# EAGLE design circuit (EAGLE 9.5.2)
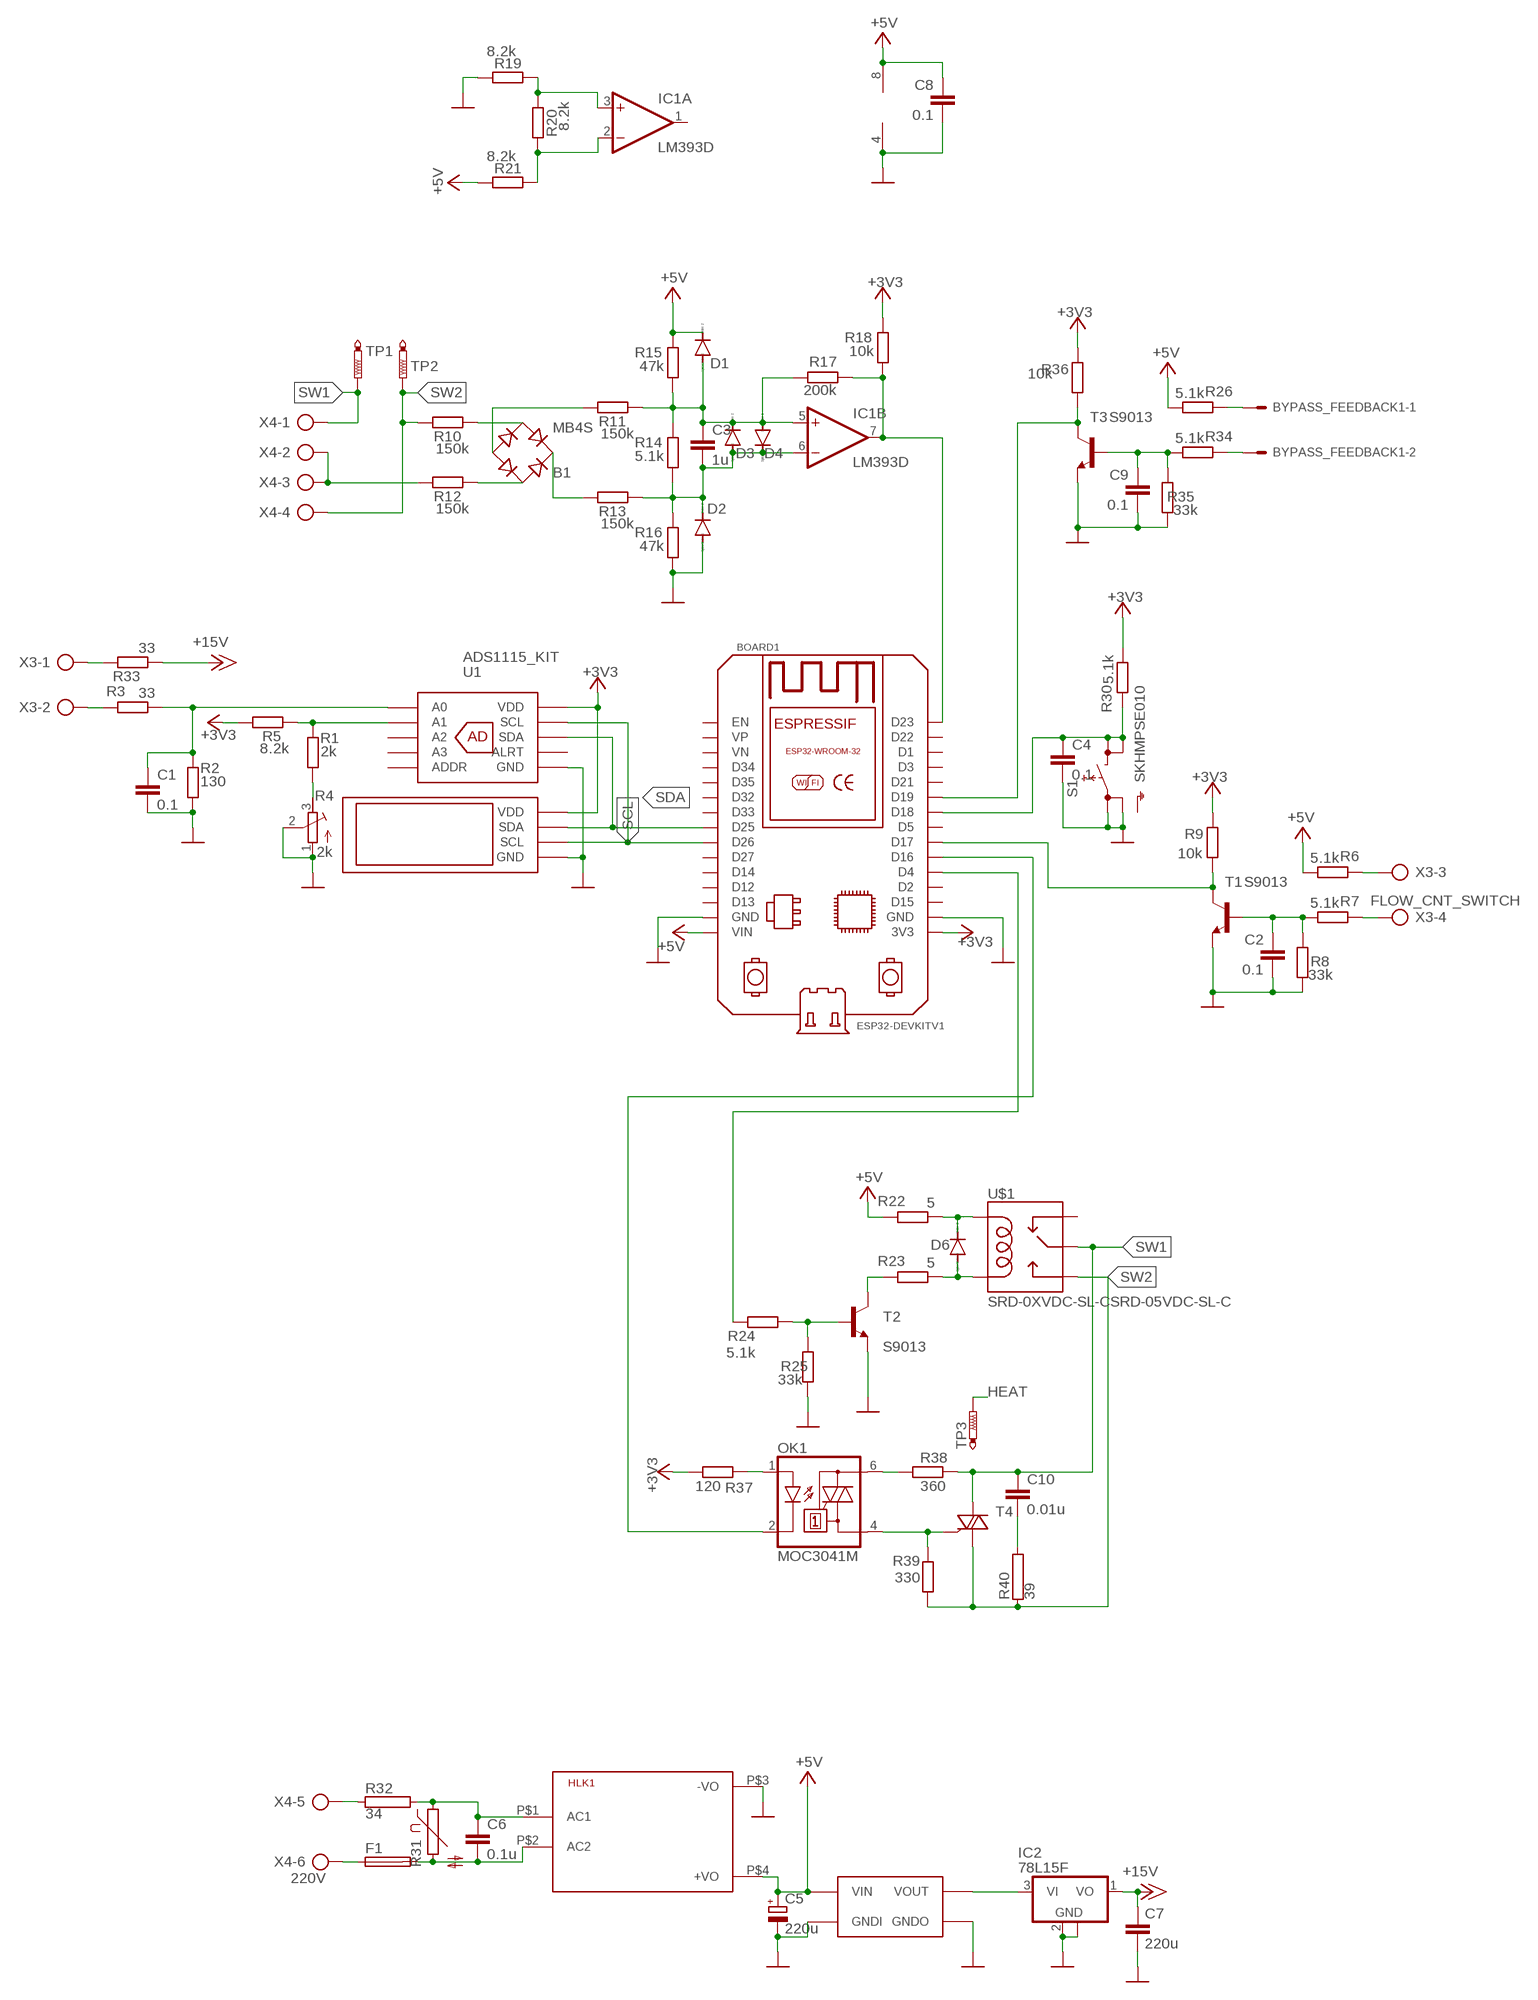
[diagram p0: schematic, sheet 1]

## Parts
B1  MB4S  [SOIC-4]
BOARD1  ESP32DEVKITV1  [ESP32-DEVKITV1]
BYPASS_FEEDBACK1  C-GRID-02-70543  [70543-02]
C1  0.1  C-EUC1206  [C1206]
C2  0.1  C-EUC1206  [C1206]
C3  1u  C-EUC1206  [C1206]
C4  0.1  C-EUC1206  [C1206]
C5  220u  CPOL-EUE3.5-8  [E3,5-8]
C6  0.1u  C10/5  [C10B5]
C7  220u  C-EUC1210K  [C1210K]
C8  0.1  C-EUC1206  [C1206]
C9  0.1  C-EUC1206  [C1206]
C10  0.01u  C10/5  [C10B5]
D1  CGRM4001-G  [SOD-123_MINI-SMA]
D2  CGRM4001-G  [SOD-123_MINI-SMA]
D3  CGRM4001-G  [SOD-123_MINI-SMA]
D4  CGRM4001-G  [SOD-123_MINI-SMA]
D6  CGRM4001-G  [SOD-123_MINI-SMA]
DC1  HW-668_DC_DC_STEPUP  [HW-668_DC_DC_STEPUP]
F1  FUSE19560  [19560]
HLK1  HLK-PM013W  [HLK-PM01]
IC1  LM393D  [SO08]
IC2  78L15F  [SOT89]
OK1  MOC3041M  [DIL06]
R1  2k  R-EU_R1206  [R1206]
R2  130  R-EU_R1206  [R1206]
R3  33  R-EU_R1206  [R1206]
R4  2k  R-TRIMM3202  [RTRIM3202]
R5  8.2k  R-EU_R1206  [R1206]
R6  5.1k  R-EU_R1206  [R1206]
R7  5.1k  R-EU_R1206  [R1206]
R8  33k  R-EU_R1206  [R1206]
R9  10k  R-EU_R1206  [R1206]
R10  150k  R-EU_R1206  [R1206]
R11  150k  R-EU_R1206  [R1206]
R12  150k  R-EU_R1206  [R1206]
R13  150k  R-EU_R1206  [R1206]
R14  5.1k  R-EU_R1206  [R1206]
R15  47k  R-EU_R1206  [R1206]
R16  47k  R-EU_R1206  [R1206]
R17  200k  R-EU_R1206  [R1206]
R18  10k  R-EU_R1206  [R1206]
R19  8.2k  R-EU_R1206  [R1206]
R20  8.2k  R-EU_R1206  [R1206]
R21  8.2k  R-EU_R1206  [R1206]
R22  5  R-EU_R1206  [R1206]
R23  5  R-EU_R1206  [R1206]
R24  5.1k  R-EU_R1206  [R1206]
R25  33k  R-EU_R1206  [R1206]
R26  5.1k  R-EU_R1206  [R1206]
R30  5.1k  R-EU_R1206  [R1206]
R31  S10K510  [S10K510]
R32  34  RCA0001  [CA0001]
R33  33  R-EU_R1206  [R1206]
R34  5.1k  R-EU_R1206  [R1206]
R35  33k  R-EU_R1206  [R1206]
R36  10k  R-EU_R1206  [R1206]
R37  120  R-EU_R1206  [R1206]
R38  360  R-EU_R1206  [R1206]
R39  330  R-EU_R1206  [R1206]
R40  39  RCA0001  [CA0001]
S1  SKHMPSE010  [SKHMPXE010]
T1  S9013  BC808-NPN-SOT23-BEC  [SOT23-BEC]
T2  S9013  BC808-NPN-SOT23-BEC  [SOT23-BEC]
T3  S9013  BC808-NPN-SOT23-BEC  [SOT23-BEC]
T4  BT136  [TO220AB]
TP1  PTR1PAD1-20Y  [P1-20Y]
TP2  PTR1PAD1-20Y  [P1-20Y]
TP3  PTR1B1,27  [B1,27]
U1  ADS1115_KIT  [ADS1115_KIT]
U2  SSD1306_OLED  [SSD1306_OLED]
U$1  SRD-0XVDC-SL-CSRD-05VDC-SL-C  [SRD-0XVDC-SL-C]
X3  FLOW_CNT_SWITCH  AK300/4  [AK300/4]
X4  220V  AK300/6  [AK300/6]

## Nets
+3V3: BOARD1.3V3 R5.2 R9.1 R18.1 R30.1 R36.1 R37.1 U1.P$1(VDD) U2.P$3(VDD)
+5V: BOARD1.VIN C5.+ C8.1 D1.C DC1.P$1(VIN) HLK1.P$4(+VO) IC1.8(P:V+) R6.1 R15.1 R21.1 R22.2 R26.1
+15V: C7.1 IC2.1(VO) R33.1
FLOW_SW: BOARD1.D17 R9.2 T1.C
GND: BOARD1.GND BOARD1.GND@1(GND) C1.2 C2.2 C4.2 C5.- C7.2 C8.2 C9.2 D2.A DC1.P$2(GNDI) DC1.P$3(GNDO) HLK1.P$3(-VO) IC1.4(P:V-) IC2.2(GND) IC2.2@1(GND) R2.1 R4.1(A) R4.2(S) R8.2 R16.2 R19.1 R25.2 R35.2 S1.1(1.1) S1.2(1.2) T1.E T2.E T3.E U1.P$2(GND) U2.P$4(GND)
HEAT: TP3.TP
N$1: C9.1 R34.1 R35.1 T3.B
N$2: BYPASS_FEEDBACK1.1 R26.2
N$3: C1.1 R2.2 R3.1 U1.P$7(A0)
N$4: R1.2 R5.1 U1.P$8(A1)
N$5: R1.1 R4.3(E)
N$6: C2.1 R7.1 R8.1 T1.B
N$7: R33.2 X3.1
N$8: B1.+ R13.2
N$9: C3.2 D2.C D3.A D4.C IC1.6(B:-IN) R13.1 R14.2 R16.1
N$10: C3.1 D1.A D3.C D4.A IC1.5(B:+IN) R11.1 R14.1 R15.2 R17.1
N$11: B1.- R11.2
N$12: R32.1 X4.5
N$13: B1.~2(AC2) R10.1
N$14: B1.~1(AC1) R12.1
N$15: R23.2 T2.C
N$16: IC1.3(A:+IN) R19.2 R20.1
N$17: IC1.2(A:-IN) R20.2 R21.2
N$18: D6.C R22.1 U$1.COIL1
N$19: F1.1 X4.6
N$20: R3.2 X3.2
N$21: BYPASS_FEEDBACK1.2 R34.2
N$22: R24.1 R25.1 T2.B
N$23: R12.2 X4.2 X4.3
N$24: R6.2 X3.3
N$25: C6.1 HLK1.P$1(AC1) R31.1 R32.2
N$26: C6.2 F1.2 HLK1.P$2(AC2) R31.2
N$27: D6.A R23.1 U$1.COIL0
N$28: DC1.P$4(VOUT) IC2.3(VI)
N$29: R7.2 X3.4
N$30: BOARD1.D19 R36.2 T3.C
N$31: BOARD1.D16 OK1.2(C)
N$32: OK1.1(A) R37.2
N$34: OK1.6(A2) R38.1
N$39: OK1.4(A1) R39.2 T4.3(G)
N$41: C10.2 R40.2
PP_ON: BOARD1.D23 IC1.7(B:OUT) R17.2 R18.2
RST_ALR: BOARD1.D18 C4.1 R30.2 S1.3(2.1) S1.4(2.2)
SCL: BOARD1.D26 U1.P$3(SCL) U2.P$2(SCL)
SDA: BOARD1.D25 U1.P$4(SDA) U2.P$1(SDA)
SSRELAY_ON: BOARD1.D4 R24.2
SW1: C10.1 R38.2 T4.2(A2) TP1.TP U$1.SWCOMMON X4.1
SW2: R10.2 R39.1 R40.1 T4.1(A1) TP2.TP U$1.SWOPEN X4.4
Unconnected: BOARD1.D1 BOARD1.D2 BOARD1.D3 BOARD1.D5 BOARD1.D12 BOARD1.D13 BOARD1.D14 BOARD1.D15 BOARD1.D21 BOARD1.D22 BOARD1.D27 BOARD1.D32 BOARD1.D33 BOARD1.D34 BOARD1.D35 BOARD1.EN BOARD1.VN BOARD1.VP IC1.1(A:OUT) S1.5(SH) U1.P$5(ADDR) U1.P$6(ALRT) U1.P$9(A2) U1.P$10(A3) U$1.SWCLOSED(SWCLOSE)

## Library data of the parts
B1 = rectifier:MB*S: Bridge Rectifier Source: http://www.fairchildsemi.com/ds/MB/MB6S.pdf
BOARD1 = ESP32-DEVKITV1:ESP32DEVKITV1: https://github.com/shridattdudhat
BYPASS_FEEDBACK1 = con-molex:C-GRID-02: CONNECTOR wire to board 2.54 mm (0.100") pitch header; MF: MOLEX; OC_FARNELL: unknown; OC_NEWARK: unknown
C1-C4 C7-C9 = rcl:C-EU: CAPACITOR, European symbol; SPICEPREFIX: C
C5 = rcl:CPOL-EU: POLARIZED CAPACITOR, European symbol; SPICEPREFIX: C
C6 C10 = capacitor-wima:C: CAPACITOR naming: grid - package width
D1-D4 D6 = diode:CGRM400*-G: Molded plasitc,JEDEC SOD-123/Mini SMA Source: Comchip CGRM4001-G.pdf
DC1 = HW-668-stepUp_dcdc:HW-668_DC_DC_STEPUP
F1 = fuse:FUSE: Fuse; MPN: 56000001009; OC_FARNELL: 1185363; OC_NEWARK: 98K6125
HLK1 = HLK-PM01:HLK-PM01: Hi-Link Power Supply HLK-PM01 3W Author: Ahmed Said <https://github.com/AhmedSaid/EAGLELibraries>
IC1 = linear:LM393: COMPARATOR
IC2 = linear:78L*: POSITOIV-VOLTAGE REGULATORS Output up to 100 mA Source: Datasheet <http://focus.ti.com/lit/ds/symlink/ua78l05.pdf>
OK1 = optocoupler:MOC30*: 6-Pin DIP Zero-Cross Optoisolators Triac Driver Output (250/400 Volt Peak) Source: Data sheet <http://www.fairchildsemi.com/ds/MO/MOC3031M.pdf> The old path of data sheet not more available 2013-05-06.; MF: FAIRCHILD SEMICONDUCTOR; MPN: MOC3041M; OC_FARNELL: 1086677; OC_NEWARK: 78K6090
R1-R3 R5-R26 R30 R33-R39 = rcl:R-EU_: RESISTOR, European symbol; SPICEPREFIX: R
R4 = rcl:R-TRIMM: Trimm resistor; SPICEMODEL: X; SPICEPREFIXL: POT
R31 = varistor:S10K510: VARISTOR
R32 R40 = resistor-power:R: Power Resitor; OC_FARNELL: unknown; OC_NEWARK: unknown
S1 = switch:SKHMP*E010: 6.2 X 6.5mm TACT Switch (SMD) Source: http://www3.alps.co.jp/WebObjects/catalog.woa/PDF/E/Switch/Tact/SKHM/SKHM.PDF
T1-T3 = transistor:*-NPN-: NPN Transistror BF959 corrected 2008.03.06
T4 = triac:BT136: Triac BT136 series E sensitive gate Source: http://www.nxp.com/acrobat_download/datasheets/BT136_SERIES_E_2.pdf
TP1-TP3 = testpad:PTR1: TEST PIN
U1 = ads1115_kit:ADS1115_KIT: ads1115 16-bit ADC kit
U2 = SSD1306:SSD1306_OLED: SSD1306 OLED Display
U$1 = SRD-0XVDC-SL-C:SRD-0XVDC-SL-C: SRD-05VDC-SL-C SRD-06VDC-SL-C Compatible with: SONGLE Relays SHUN YU JQX-3F other same relays Author: Ahmed Said <https://github.com/AhmedSaid/EAGLELibraries>
X3 = con-ptr500:AK300/4: CONNECTOR; OC_FARNELL: unknown; OC_NEWARK: unknown
X4 = con-ptr500:AK300/6: CONNECTOR; OC_FARNELL: unknown; OC_NEWARK: unknown

## Board
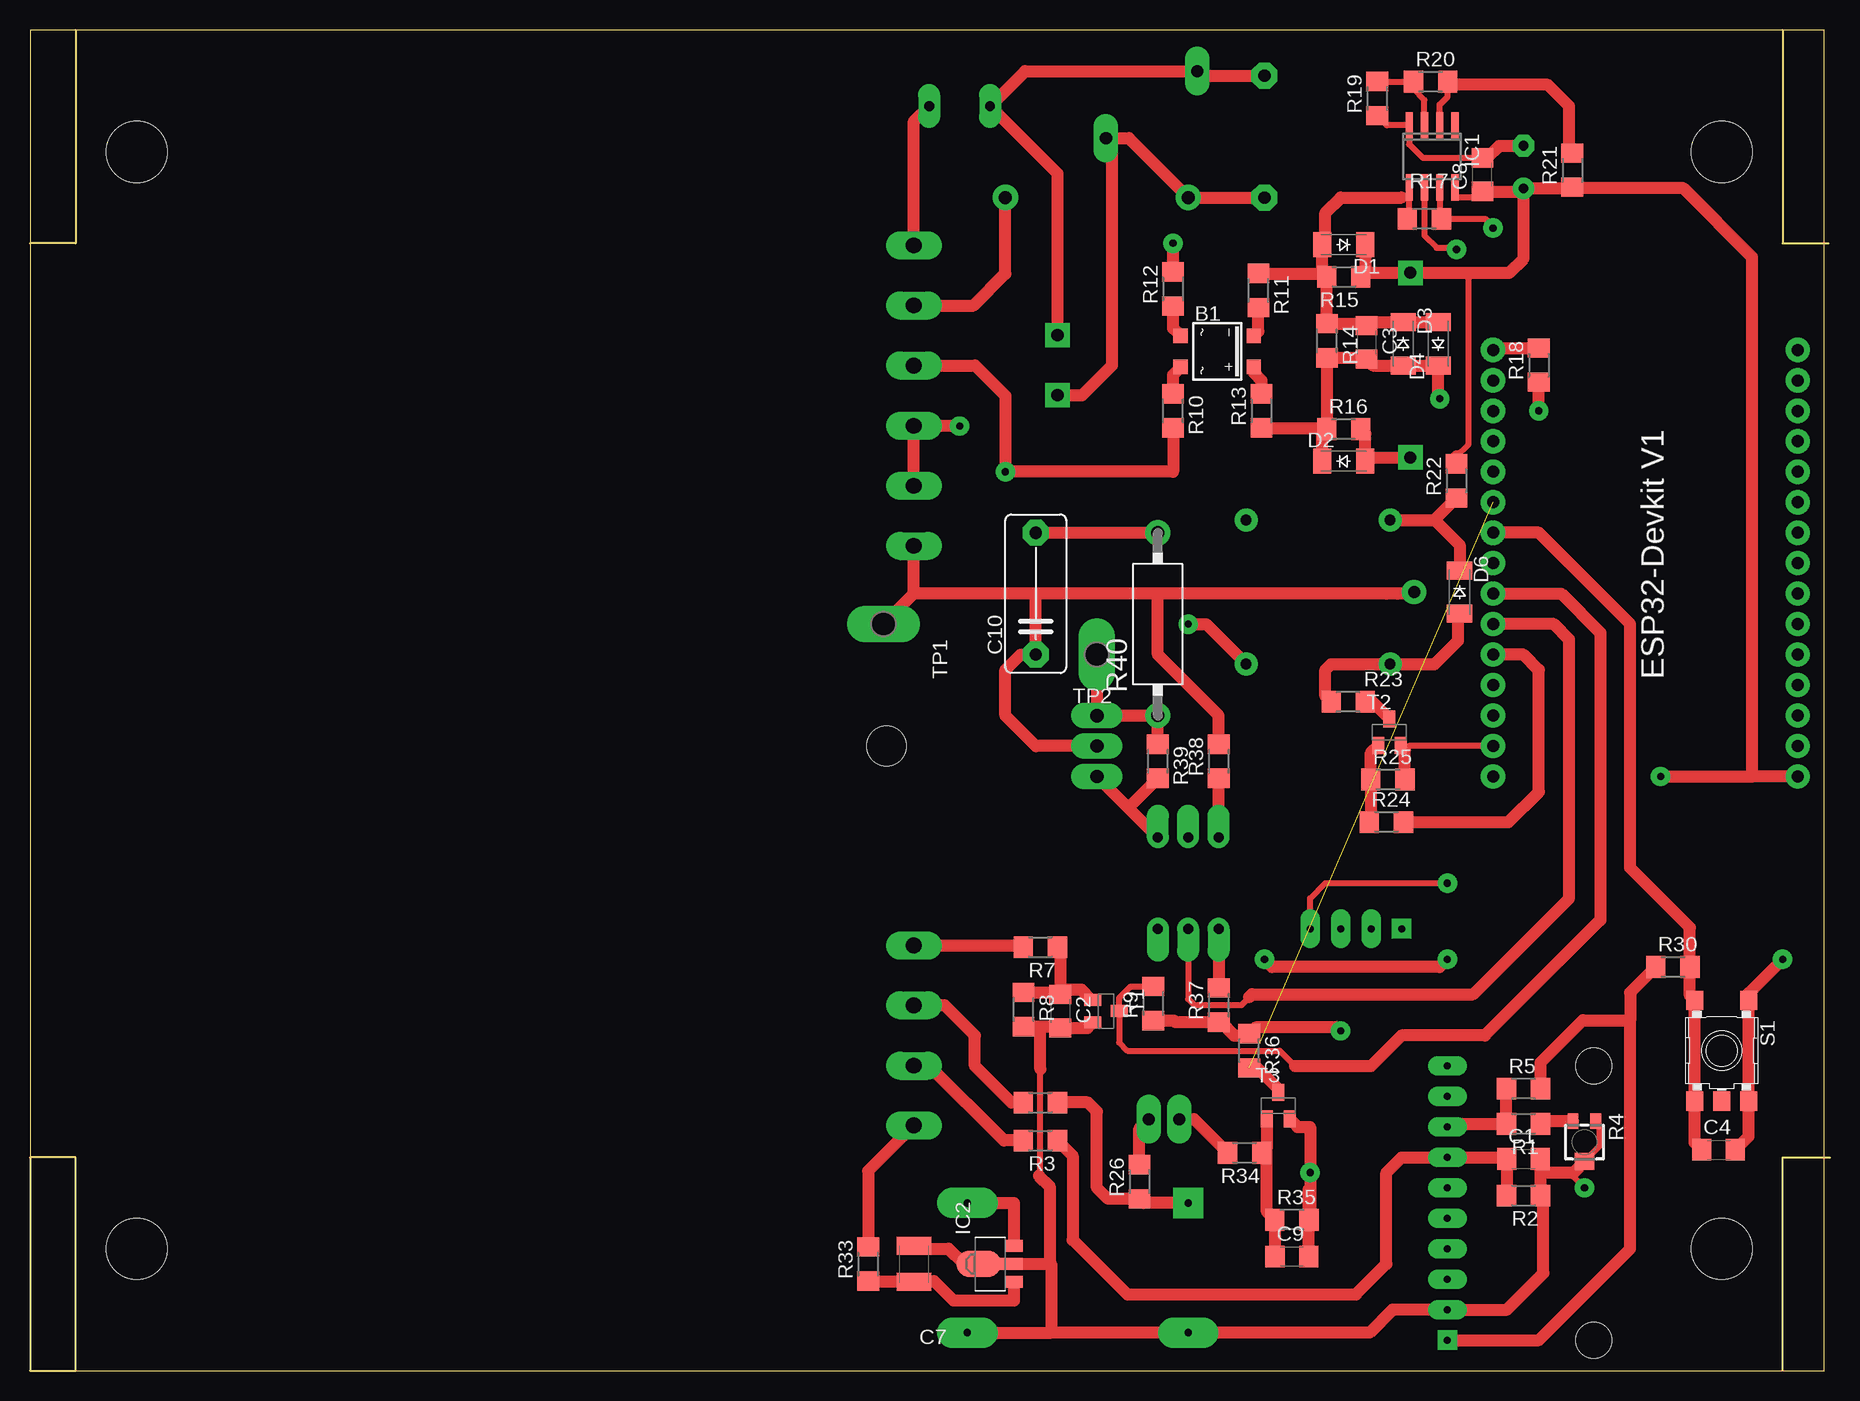
[diagram p1: board, top side]
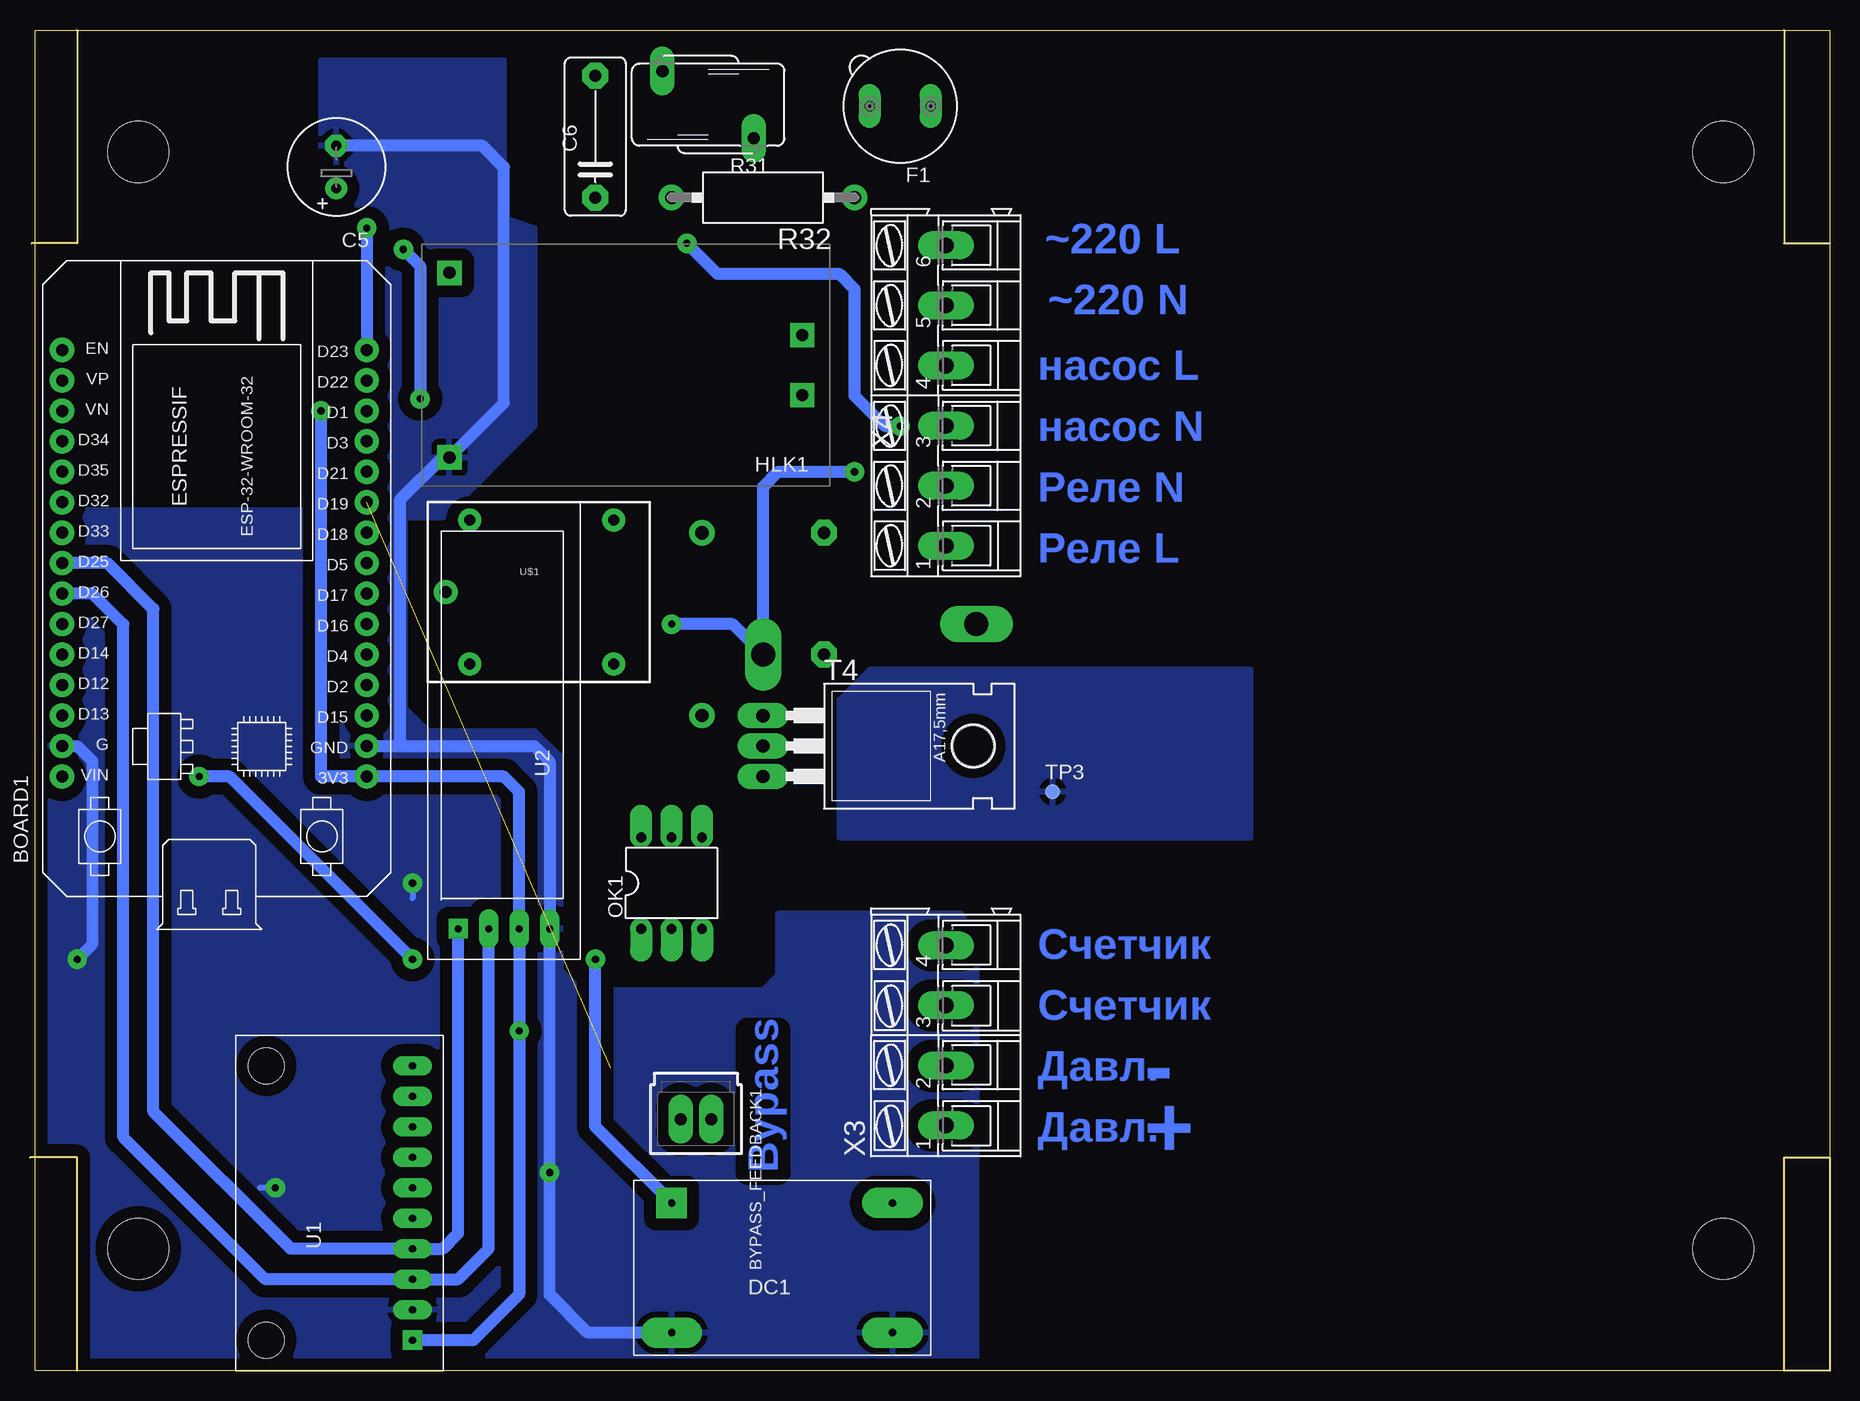
[diagram p2: board, bottom side, seen from below]

Size 149.99 x 111.76 mm. Coordinates in mm from the lower left corner, seen from the top.
Outline: 3.81,0 146.05,0
Outline: 146.05,0 149.53,0 149.53,111.75 0,111.75 0,93.98
Outline: 0,93.98 0,17.78
Outline: 3.81,0 3.81,17.78 0,17.78
Outline: 0,17.78 0,0 3.81,0
Outline: 3.81,111.76 3.81,93.98 0,93.98
Outline: 146.05,0 146.05,17.78 149.99,17.78
Outline: 146.05,111.76 146.05,93.98 149.86,93.98
Copper layers (1*16): Top 0.035mm / dielectric 1.5mm / Bottom 0.035mm
Design rules "default": minimum track width 20mil, minimum drill 0.6mm, track to track 12mil, track to pad 12mil, pad to pad 12mil, via to via 12mil, smd to smd 12mil, copper to edge 40mil, drill to drill 40mil, minimum pad ring 20mil, minimum via ring 20mil, stop-mask expansion 4mil, vias tented up to drill 0mil, thermal gap 20mil
Holes 5.08 mm at 8.89,10.16 8.89,101.6 140.97,10.16 140.97,101.6

### Footprints (pad centres in the part's own frame; a part is rotated, then mirrored left to right if it is on the bottom)
SOIC-4 = smd 1.2 x 1.2: + 1.3,3.05; - -1.3,3.05; ~1 -1.3,-3.05; ~2 1.3,-3.05
ESP32-DEVKITV1 = drill 1 pad 1.93: 3V3 0,0; D1 30.48,0; D2 7.62,0; D3 27.94,0; D4 10.16,0; D5 17.78,0; D12 7.62,25.4; D13 5.08,25.4; D14 10.16,25.4; D15 5.08,0; D16 12.7,0; D17 15.24,0; D18 20.32,0; D19 22.86,0; D21 25.4,0; D22 33.02,0; D23 35.56,0; D25 17.78,25.4; D26 15.24,25.4; D27 12.7,25.4; D32 22.86,25.4; D33 20.32,25.4; D34 27.94,25.4; D35 25.4,25.4; EN 35.56,25.4; GND 2.54,25.4; GND@1 2.54,0; VIN 0,25.4; VN 30.48,25.4; VP 33.02,25.4
70543-02 = drill 1.016 long: 1 -1.27,0; 2 1.27,0
C1206 = smd 1.6 x 1.8: 1 -1.4,0; 2 1.4,0
E3,5-8 = drill 0.813 pad 1.6: + -1.778,0 | drill 0.813 pad 1.6 octagon: - 1.778,0
C10B5 = drill 1.016 pad 2.159 octagon: 1 -5.08,0; 2 5.08,0
C1210K = smd 1.5 x 2.9: 1 -1.5,0; 2 1.5,0
SOD-123_MINI-SMA = smd 1.5 x 2.1: A 1.8,0; C -1.8,0
HW-668_DC_DC_STEPUP = drill 0.6 pad 2.54 square: P$1 -17.78,0 | drill 0.6 pad 2.54 long: P$2 -17.78,-10.795; P$3 0.635,-10.795; P$4 0.635,0
19560 = drill 0.813 pad 1.778 long: 1 -2.54,0; 2 2.54,0
HLK-PM01 = drill 1.016 square: P$1 -14.7,2.5; P$2 -14.7,-2.5; P$3 14.7,7.7; P$4 14.7,-7.7
SO08 = smd 0.6 x 2.2: 1 -1.905,-2.6; 2 -0.635,-2.6; 3 0.635,-2.6; 4 1.905,-2.6; 5 1.905,2.6; 6 0.635,2.6; 7 -0.635,2.6; 8 -1.905,2.6
SOT89 = smd 1 x 1.5: 1 -1.499,-1.981; 3 1.499,-1.981 | smd 1 x 2: 2 0,-1.727 | smd 2.2 x 3.7: 2@1 0,0.94
DIL06 = drill 0.813 offset: 1 -2.54,-3.81; 2 0,-3.81; 3 2.54,-3.81; 4 2.54,3.81; 5 0,3.81; 6 -2.54,3.81
R1206 = smd 1.6 x 1.803: 1 -1.422,0; 2 1.422,0
RTRIM3202 = smd 0.9 x 1.3: 1 -0.95,-1.75; 3 0.95,-1.75 | smd 1.6 x 1.4: 2 0,1.6
S10K510 = drill 1.016 long: 1 -2.794,-3.81; 2 2.794,3.81
CA0001 = drill 1.1 pad 2: 1 -7.62,0; 2 7.62,0
SKHMPXE010 = smd 1.6 x 1.4: 1 -4.2,2.25; 2 4.2,2.25; 3 -4.2,-2.25; 4 4.2,-2.25; 5 4.2,0
SOT23-BEC = smd 1 x 1.4: B -0.95,-1.1; C 0,1.1; E 0.95,-1.1
TO220AB = drill 1.118 long: 1 -2.54,-6.35; 2 0,-6.35; 3 2.54,-6.35 | hole 3.302: 0,11.176
P1-20Y = drill 2.007 pad 2.54 long: TP 0,0
B1,27 = smd 1.27 x 1.27: TP 0,0
ADS1115_KIT = drill 0.6 square: P$1 -5.08,12.7 | drill 0.6 long: P$2 -5.08,10.16; P$3 -5.08,7.62; P$4 -5.08,5.08; P$5 -5.08,2.54; P$6 -5.08,0; P$7 -5.08,-2.54; P$8 -5.08,-5.08; P$9 -5.08,-7.62; P$10 -5.08,-10.16 | hole 2.997: 7.112,12.7; 7.112,-10.16
SSD1306_OLED = drill 0.6 square: P$1 -15.24,5.08 | drill 0.6 long: P$2 -15.24,2.54; P$3 -15.24,0; P$4 -15.24,-2.54
SRD-0XVDC-SL-C = drill 0.9: COIL0 -5.39,-6.12; COIL1 -5.39,5.88; SWCLOSED 6.61,5.88; SWOPEN 6.61,-6.12 | drill 1: SWCOMMON -7.39,-0.12
AK300/4 = drill 1.321 long: 1 -7.493,0; 2 -2.515,0; 3 2.515,0; 4 7.493,0
AK300/6 = drill 1.321 long: 1 -12.522,0; 2 -7.518,0; 3 -2.515,0; 4 2.515,0; 5 7.518,0; 6 12.522,0

### Placement (x,y rotation side)
B1  98.93,84.96 270 top
BOARD1  121.92,49.53 90 bottom
BYPASS_FEEDBACK1  94.49,20.95 180 bottom
C1  124.46,17.65 0 top
C2  85.85,29.97 270 top
C3  111.38,85.72 270 top
C4  140.72,18.41 0 top
C5  124.46,100.33 90 bottom
C6  102.87,102.87 90 bottom
C7  73.66,8.89 90 top
C8  121.03,99.69 90 top
C9  105.16,9.53 0 top
C10  83.82,64.77 90 top
D1  109.47,93.85 180 top
D2  109.47,75.82 0 top
D3  114.43,85.6 270 top
D4  117.35,85.6 90 top
D6  119.13,64.9 270 top
DC1  78.74,13.97 0 bottom
F1  77.47,105.41 180 bottom
HLK1  100.33,83.82 180 bottom
IC1  116.84,101.22 180 top
IC2  80.01,8.89 90 top
OK1  96.52,40.64 0 bottom
R1  124.46,20.57 180 top
R2  124.46,14.61 180 top
R3  84.2,19.18 180 top
R4  129.54,19.05 180 top
R5  124.46,23.5 0 top
R6  84.2,22.35 180 top
R7  84.2,35.31 180 top
R8  82.8,30.1 270 top
R9  93.6,30.61 90 top
R10  95.25,80.01 270 top
R11  102.36,90.04 270 top
R12  95.25,90.17 90 top
R13  102.62,80.01 90 top
R14  108.08,85.85 270 top
R15  109.47,91.19 180 top
R16  109.47,78.49 0 top
R17  116.2,96.01 0 top
R18  125.73,83.82 90 top
R19  112.27,106.05 90 top
R20  116.71,107.44 0 top
R21  128.52,100.08 90 top
R22  118.87,74.17 90 top
R23  109.86,55.75 0 top
R24  113.03,45.72 0 top
R25  113.16,49.28 0 top
R26  92.46,15.75 90 top
R30  136.91,33.66 0 top
R31  93.47,105.54 90 bottom
R32  88.9,97.79 180 bottom
R33  69.85,8.89 90 top
R34  101.22,18.16 180 top
R35  105.16,12.57 0 top
R36  101.6,26.67 270 top
R37  99.06,30.48 90 top
R38  99.06,50.8 90 top
R39  93.98,50.8 270 top
R40  93.98,62.23 90 top
S1  140.97,26.67 270 top
T1  89.66,29.97 270 top
T2  113.28,53.21 0 top
T3  104.01,22.1 0 top
T4  82.55,52.07 270 bottom
TP1  71.12,62.23 270 top
TP2  88.9,59.69 180 top
TP3  64.77,48.26 0 bottom
U1  123.19,15.24 180 bottom
U2  109.22,52.07 90 bottom
U$1  107.95,65.02 0 bottom
X3  73.66,27.94 90 bottom
X4  73.66,81.28 90 bottom

### Tracks (layer width: path | path; a pad name or v marks a point on that pad's centre or on a via)
+3V3  (via drill 0.6)
  Top 1.016: U1.P$1 125.73,2.54 133.35,10.16 133.35,29.21 | R9.1 95.33,29.18 95.45,29.06 R37.1 99.21,29.06 100.33,27.94 101.45,27.94 R36.1 102.11,28.6 108.94,28.6 v109.22,28.32 | R5.2 125.88,25.69 129.41,29.21 133.35,29.21 | v125.73,80.01 R18.1 | R30.1 133.35,31.52 133.35,29.21
  Bottom 1.016: U1.P$1 113.03,2.54 109.22,6.35 v109.22,28.32 U2.P$3 109.22,48.26 110.49,49.53 BOARD1.3V3 125.73,49.53 v125.73,80.01
+5V  (via drill 0.6)
  Top 0.508: IC1.8 118.75,97.79 120.53,97.79 C8.1 | 118.87,76.2 119.89,77.22 119.89,91.39
  Top 1.016: D1.C 111.27,91.56 R15.1 111.23,91.52 HLK1.P$4 119.76,91.52 | 119.76,91.52 123.27,91.52 124.46,92.71 C5.+ | C8.1 124.2,98.3 C5.+ | C5.+ 128.42,98.55 | 128.42,98.55 R21.1 | BOARD1.VIN 143.51,49.53 | 143.51,49.53 143.51,92.84 137.79,98.55 128.42,98.55 | R22.2 118.87,76.2 | 119.89,91.39 119.76,91.52 | R6.1 88.15,22.35 88.9,21.6 88.9,15.24 89.81,14.33 R26.1 92.81,13.97 DC1.P$1 | v118.11,34.29 117.47,33.66 103.5,33.66 v102.87,34.29 | v135.89,49.53 143.51,49.53
  Bottom 1.016: DC1.P$1 102.87,20.32 v102.87,34.29 | v118.11,34.29 133.35,49.53 v135.89,49.53
+15V
  Top 1.016: R33.1 73.58,7.47 | 73.58,7.47 75.34,7.47 76.96,5.84 81.99,5.84 IC2.1 | 73.58,7.47 C7.1
FLOW_SW
  Top 0.508: R9.2 91.72,32.03 90.76,31.07 T1.C 90.76,27.35 91.44,26.67 104.14,26.67 105.41,25.4
  Top 1.016: 105.41,25.4 111.76,25.4 113.03,26.67 114.3,27.94 121.25,27.94 130.86,37.55 130.86,61.51 127.6,64.77 BOARD1.D17
GND  (via drill 0.6)
  Top 0.508: C8.2 116.08,101.09 114.94,102.23 IC1.4 113.07,103.82 R19.1 | BOARD1.GND@1 114.88,52.07 114.58,51.77 | R4.2 130.81,18.72 130.81,20.48 R4.1 | 84.07,16.26 84.2,16.38 84.2,25.15 | IC2.2@1 82.55,8.89 | 128.6,16.51 128.6,16.18 v129.54,15.24 | U2.P$4 106.68,39.37 107.95,40.64 v118.11,40.64
  Top 1.016: R16.2 111.27,78.11 D2.A 111.58,76.12 HLK1.P$3 | C8.2 121.42,101.09 122.43,102.11 C5.- | R25.2 114.58,51.77 T2.E | C1.2 125.86,16.51 | 125.86,16.51 125.86,14.63 R2.1 126.11,14.38 126.11,8.13 123.06,5.08 U1.P$2 113.54,5.08 111.63,3.17 DC1.P$2 85.09,3.17 | R4.2 128.6,16.51 125.86,16.51 | DC1.P$3 85.09,3.17 | IC2.2 82.55,8.89 84.96,8.89 | 84.96,8.89 85.09,8.89 85.09,3.17 | C7.2 73.89,10.16 76.53,10.16 77.8,8.89 IC2.2@1 | R8.2 83.82,28.68 | 83.82,28.68 85.75,28.68 C2.2 88.11,28.57 T1.E | 84.07,16.26 84.96,15.37 84.96,8.89 | 84.2,25.15 84.2,28.3 83.82,28.68 | C9.2 106.56,15.09 106.68,15.21 | R35.2 106.68,12.68 106.68,15.21 | T3.E 105.64,20.32 106.68,20.32 v106.68,16.51 106.68,15.21 | C4.2 143.22,19.52 S1.2 S1.1 143.22,31.46 v146.05,34.29
  Bottom 0.508: v129.54,15.24 130.81,15.24 | v118.11,40.64 118.11,39.37
  Bottom 1.016: C5.- 112.27,102.11 110.49,100.33 110.49,80.66 HLK1.P$3 115.65,76.12 119.13,72.64 119.13,52.32 119.38,52.07 BOARD1.GND@1 107.95,52.07 106.68,50.8 U2.P$4 v106.68,16.51 106.68,6.35 103.5,3.17 DC1.P$2 | BOARD1.GND 146.05,52.07 144.81,50.83 144.81,35.53 v146.05,34.29
  pour Bottom (isolate 1.016): 72.39,38.1 71.12,36.83 71.12,0 146.05,0 146.05,13.97 149.22,17.14 149.22,71.75 123.19,71.75 123.19,95.38 125.73,97.92 125.73,109.22 110.49,109.22 110.49,96.1 107.95,95.25 107.95,78.74 115.57,71.12 118.75,71.12 118.75,55.24 116.84,53.34 107.95,53.34 105.79,51.18 105.79,33.4 104.14,31.75 88.9,31.75 87.63,33.02 87.63,38.1
HEAT
  pour Bottom: 80.01,58.42 82.55,55.88 82.55,44.45 48.26,44.45 48.26,58.42
N$1
  Top 1.016: T3.B 103.06,18.58 | 103.06,18.58 R34.1 | 103.06,18.58 103.06,13.24 R35.1 103.76,12.55 C9.1
N$2
  Top 1.016: R26.2 92.46,20.19 BYPASS_FEEDBACK1.1
N$3
  Top 1.016: R2.2 123.06,14.63 C1.1 122.93,17.78 U1.P$7 114.3,17.78 113.03,16.51 113.03,8.89 110.49,6.35 91.44,6.35 86.89,10.9 86.89,17.91 R3.1
N$4
  Top 1.016: U1.P$8 118.36,20.57 R1.2 R5.1
N$5
  Top 1.016: R4.3 126.11,20.8 R1.1
N$6
  Top 1.016: R7.1 85.85,35.08 C2.1 85.7,31.52 | R8.1 85.7,31.52 | T1.B 88.46,30.92 87.63,31.75 85.93,31.75 85.7,31.52
N$7
  Top 1.016: X3.1 69.85,16.64 R33.2
N$8
  Top 1.016: B1.+ 101.98,83.18 102.62,82.55 R13.2
N$9  (via drill 0.6)
  Top 0.508: IC1.6 116.2,94.61 117.22,93.6 118.75,93.6 v118.87,93.47
  Top 1.016: R13.1 107.95,78.59 | 107.95,78.59 R16.1 108.08,78.51 R14.2 111.27,84.43 C3.2 111.91,83.8 D3.A D4.C 117.35,81.03 v117.47,81.03 | D2.C 107.67,78.31 107.95,78.59
  Bottom 1.016: v118.87,93.47 117.47,92.08 v117.47,81.03
N$10
  Top 0.508: R17.1 114.94,96.16 114.94,97.79 | 114.94,97.79 IC1.5 | 114.3,97.79 114.94,97.79
  Top 1.016: R11.1 107.92,91.47 108.05,91.34 R15.2 | R15.2 107.67,91.56 D1.A 107.95,94.13 107.95,96.52 109.22,97.79 114.3,97.79 | R15.2 108.05,87.3 R14.1 111.23,87.27 C3.1 111.65,87.4 D3.C D4.A
N$11
  Top 1.016: B1.- 102.36,86.64 R11.2
N$12
  Top 1.016: X4.5 78.64,88.8 81.28,91.44 R32.1
N$13
  Top 1.016: R10.1 95.25,83.03 B1.~2
N$14
  Top 1.016: B1.~1 95.25,86.9 R12.1
N$15
  Top 1.016: R23.2 111.89,55.75 113.28,54.36 T2.C
N$16
  Top 0.508: R19.2 115.27,107.47 | 115.27,107.47 R20.1 | IC1.3 116.2,105.92 115.27,106.86 115.27,107.47
N$17
  Top 0.508: IC1.2 117.47,105.54 118.14,106.2 R20.2
  Top 1.016: R21.2 128.27,101.75 128.27,105.41 126.49,107.19 118.39,107.19 R20.2
N$18
  Top 1.016: D6.C 119.13,68.83 117.07,70.89 117.07,70.94 | U$1.COIL1 117.03,70.9 117.07,70.94 | 117.07,70.94 R22.1
N$19
  Top 1.016: X4.6 73.66,104.14 F1.1
N$20
  Top 1.016: R3.2 81.15,19.18 74.91,25.43 X3.2 | R3.2
N$21
  Top 1.016: BYPASS_FEEDBACK1.2 97,20.95 R34.2
N$22
  Top 1.016: T2.B 111.73,51.51 R25.1 111.73,45.85 R24.1
N$23  (via drill 0.6)
  Top 1.016: X4.2 X4.3 73.69,78.74 v77.47,78.74 | R12.2 v95.25,93.98
  Bottom 1.016: v95.25,93.98 92.71,91.44 82.55,91.44 81.28,90.17 81.28,81.28 78.74,78.74 v77.47,78.74
N$24
  Top 1.016: X3.3 76.22,30.45 78.74,27.94 78.74,25.4 81.79,22.35 R6.2
N$25
  Top 1.016: C6.1 R32.2 91.57,102.74 R31.1 90.17,102.23 90.17,83.82 87.67,81.32 HLK1.P$1
N$26
  Top 1.016: C6.2 97.66,107.95 R31.2 82.93,108.33 F1.2 85.63,99.79 HLK1.P$2
N$27
  Top 1.016: D6.A 119,62.97 119,60.83 117.06,58.89 117.04,58.9 U$1.COIL0 108.43,58.9 107.95,58.42 107.95,56.24 R23.1
N$28
  Top 1.016: DC1.P$4 81.99,13.97 IC2.3
N$29
  Top 1.016: X3.4 82.65,35.43 R7.2
N$30  (1 unrouted)
  Top 1.016: T3.C 104.01,23.5 102.26,25.25 R36.2
N$31
  Top 0.508: 101.6,31.11 100.97,30.48 97.03,30.48 96.52,30.99 OK1.2
  Top 1.016: 101.6,31.11 101.85,31.37 120.27,31.37 128.27,39.37 128.27,60.96 127,62.23 BOARD1.D16
N$32
  Top 1.016: OK1.1 R37.2
N$34
  Top 1.016: OK1.6 R38.1
N$39
  Top 1.016: T4.3 91.44,46.99 | 91.44,46.99 OK1.4 | R39.2 91.59,46.99 91.44,46.99
N$41
  Top 1.016: C10.2 R40.2
PP_ON  (via drill 0.6)
  Top 0.508: IC1.7 117.47,96.16 R17.2 121.28,96.01 121.92,95.38 v121.92,95.25
  Top 1.016: BOARD1.D23 122.07,85.24 R18.2
  Bottom 1.016: v121.92,95.25 BOARD1.D23
RST_ALR
  Top 1.016: C4.1 138.72,19.01 S1.4 S1.3 138.33,31.26 R30.2 138.33,36.93 133.35,41.91 133.35,62.23 125.73,69.85 BOARD1.D18
SCL
  Bottom 1.016: U2.P$2 111.76,10.16 114.3,7.62 U1.P$3 130.37,7.62 142.22,19.46 142.22,62.2 144.78,64.77 BOARD1.D26
SDA
  Bottom 1.016: U2.P$1 114.3,11.43 115.57,10.16 U1.P$4 128.27,10.16 139.7,21.59 139.7,63.5 143.51,67.31 BOARD1.D25
SSRELAY_ON
  Top 1.016: R24.2 123.19,45.72 125.73,48.26 125.73,58.42 124.46,59.69 BOARD1.D4
SW1
  Top 1.016: 73.66,64.77 X4.1 | 93.98,64.77 113.03,64.77 113.95,64.77 115.21,64.77 U$1.SWCOMMON | 93.98,64.77 83.82,64.77 | 83.82,64.77 73.66,64.77 | TP1.TP 73.66,64.77 | 83.82,64.77 C10.1 82.55,59.69 81.28,58.42 81.28,54.61 83.82,52.07 T4.2 | R38.2 99.06,54.61 93.98,59.69 93.98,64.77
SW2  (via drill 0.6)
  Top 1.016: X4.4 78.77,83.8 81.28,81.28 v81.28,74.93 95.25,74.93 R10.2 | TP2.TP T4.1 R40.1 R39.1 | v96.52,62.23 98.01,62.23 U$1.SWOPEN
  Bottom 1.016: v81.28,74.93 87.63,74.93 88.9,73.66 TP2.TP 91.44,62.23 v96.52,62.23

### Text on the board
Bottom: ~220 L | ~220 N | насос L | насос N | Реле N | Реле L | Счетчик | Счетчик | Давл. | - | Давл. | + | Bypass